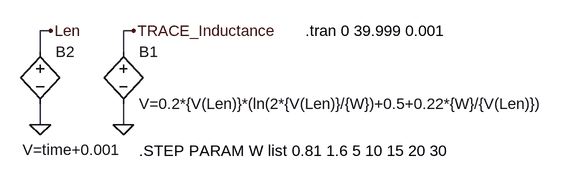
[diagram p0: schematic Fig_11-6_PCB_Inductance_CALC.asc]
Fig_11-6_PCB_Inductance_CALC.asc, the LTspice schematic file:
Version 4
SHEET 1 1048 680
WIRE 16 128 0 128
WIRE 144 128 128 128
WIRE 0 160 0 128
WIRE 128 160 128 128
WIRE 0 272 0 240
WIRE 128 272 128 240
FLAG 128 272 0
FLAG 144 128 TRACE_Inductance
FLAG 0 272 0
FLAG 16 128 Len
SYMBOL bv 128 144 R0
SYMATTR InstName B1
SYMATTR Value V=0.2*{V(Len)}*(ln(2*{V(Len)}/{W})+0.5+0.22*{W}/{V(Len)})
SYMBOL bv 0 144 R0
WINDOW 3 -27 167 Left 2
SYMATTR Value V=time+0.001
SYMATTR InstName B2
TEXT 152 312 Left 2 !.STEP PARAM W list 0.81 1.6 5 10 15 20 30
TEXT 408 128 Left 2 !.tran 0 39.999 0.001

The netlist it stands for:
* Fig_11-6_PCB_Inductance_CALC.asc
B1 TRACE_Inductance 0 V=0.2*{V(Len)}*(ln(2*{V(Len)}/{W})+0.5+0.22*{W}/{V(Len)})
B2 Len 0 V=time+0.001
.STEP PARAM W list 0.81 1.6 5 10 15 20 30
.tran 0 39.999 0.001
.backanno
.end